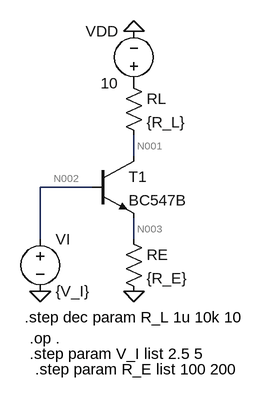
[diagram p0: schematic 2_4_1_e.asc]
2_4_1_e.asc, the LTspice schematic file:
Version 4
SHEET 1 880 680
WIRE 192 -32 192 -64
WIRE 128 16 48 16
WIRE 48 96 48 16
WIRE 192 96 192 64
FLAG 48 176 0
FLAG 192 176 0
FLAG 192 -224 0
SYMBOL voltage 48 80 R0
SYMATTR InstName VI
SYMATTR Value {V_I}
SYMBOL res 176 80 R0
SYMATTR InstName RE
SYMATTR Value {R_E}
SYMBOL npn 128 -32 R0
SYMATTR InstName T1
SYMATTR Value BC547B
SYMBOL res 176 -160 R0
SYMATTR InstName RL
SYMATTR Value {R_L}
SYMBOL voltage 192 -128 R180
WINDOW 0 24 96 Left 2
WINDOW 3 24 16 Left 2
SYMATTR InstName VDD
SYMATTR Value 10
TEXT 24 216 Left 2 !.step dec param R_L 1u 10k 10
TEXT 32 248 Left 2 !.op .
TEXT 32 272 Left 2 !.step param V_I list 2.5 5
TEXT 40 296 Left 2 !.step param R_E list 100 200

The netlist it stands for:
* 2_4_1_e.asc
VI N002 0 {V_I}
RE N003 0 {R_E}
Q§T1 N001 N002 N003 0 BC547B
RL P001 N001 {R_L}
VDD P001 0 10
.model NPN NPN
.model PNP PNP
.lib standard.bjt
.step dec param R_L 1u 10k 10
.op .
.step param V_I list 2.5 5
.step param R_E list 100 200
.backanno
.end

* Results of the author's LTspice run, read from the files saved beside the schematic
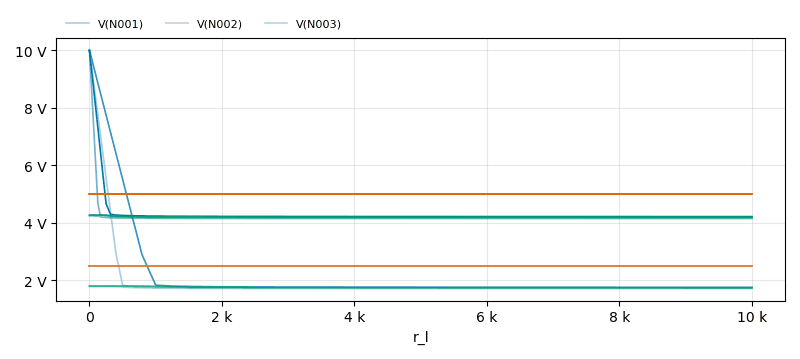
[diagram p1: Operating Point of 2_4_1_e.asc, plotted from the saved traces]
* Operating Point, 4 runs:
*   V(N001) [v_i=2.5 r_e=100]: 10 V at r_l=1 µ, 1.726 V at r_l=10 k, min 1.726 V, max 10 V
*   V(N001) [v_i=5 r_e=100]: 10 V at r_l=1 µ, 4.177 V at r_l=10 k, min 4.177 V, max 10 V
*   V(N001) [v_i=2.5 r_e=200]: 10 V at r_l=1 µ, 1.753 V at r_l=10 k, min 1.753 V, max 10 V
*   V(N001) [v_i=5 r_e=200]: 10 V at r_l=1 µ, 4.215 V at r_l=10 k, min 4.215 V, max 10 V
*   V(N002) [v_i=2.5 r_e=100]: 2.5 V at r_l=1 µ, 2.5 V at r_l=10 k, min 2.5 V, max 2.5 V
*   V(N002) [v_i=5 r_e=100]: 5 V at r_l=1 µ, 5 V at r_l=10 k, min 5 V, max 5 V
*   V(N002) [v_i=2.5 r_e=200]: 2.5 V at r_l=1 µ, 2.5 V at r_l=10 k, min 2.5 V, max 2.5 V
*   V(N002) [v_i=5 r_e=200]: 5 V at r_l=1 µ, 5 V at r_l=10 k, min 5 V, max 5 V
*   V(N003) [v_i=2.5 r_e=100]: 1.778 V at r_l=1 µ, 1.707 V at r_l=10 k, min 1.707 V, max 1.778 V
*   V(N003) [v_i=5 r_e=100]: 4.239 V at r_l=1 µ, 4.145 V at r_l=10 k, min 4.145 V, max 4.239 V
*   V(N003) [v_i=2.5 r_e=200]: 1.802 V at r_l=1 µ, 1.74 V at r_l=10 k, min 1.74 V, max 1.802 V
*   V(N003) [v_i=5 r_e=200]: 4.27 V at r_l=1 µ, 4.195 V at r_l=10 k, min 4.195 V, max 4.27 V
* From the log:
*   Semiconductor Device Operating Points:
*                           --- Bipolar Transistors ---
*   Name:      q§t1
*   Model:    bc547b
*   Ib:       6.20e-05
*   Ic:       1.77e-02
*   Vbe:      7.22e-01
*   Vbc:     -7.50e+00
*   Vce:      8.22e+00
*   BetaDC:   2.86e+02
*   Gm:       6.13e-01
*   Rpi:      4.21e+02
*   Rx:       1.00e+00
*   Ro:       3.89e+03
*   Cbe:      3.57e-10
*   Cbc:      9.57e-13
*   Cjs:      0.00e+00
*   BetaAC:   2.58e+02
*   Cbx:      5.88e-13
*   Ft:       2.72e+08